# Altium schematic sheet 3_IMU.SchDoc
size A4; SheetNumber: 4; SheetTotal: 6
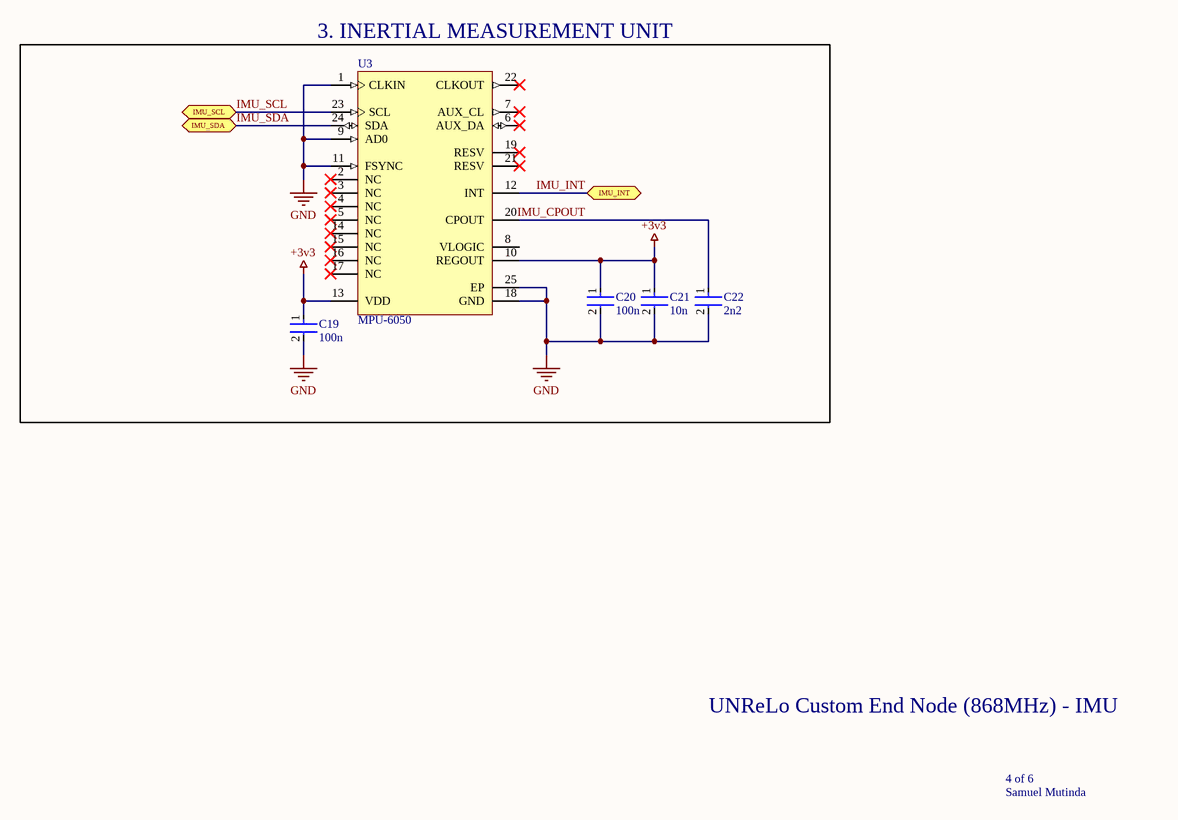
[diagram p0: 3_IMU.SchDoc]

## Parts
C19  100n  [FP-C0402-BB-MFG]
C20  100n  [FP-C0402-BB-MFG]
C21  10n  [FP-C0402-BB-MFG]
C22  2n2  [FP-C0402-BB-MFG]
U3  MPU-6050  [IS-QFN-24_V]

## Blocks framed on the sheet
3. INERTIAL MEASUREMENT UNIT: C19-C22 U3

## Ports
IMU_INT (bidir), IMU_SCL (bidir), IMU_SDA (bidir)

## Nets
+3v3: C19.1 C20.1 C21.1 U3.10(REGOUT) U3.13(VDD)
GND: C19.2 C20.2 C21.2 C22.2 U3.1(CLKIN) U3.9(AD0) U3.11(FSYNC) U3.18(GND) U3.25(EP)
IMU_CPOUT: C22.1 U3.20(CPOUT)
IMU_INT: U3.12(INT) ; port IMU_INT
IMU_SCL: U3.23(SCL) ; port IMU_SCL
IMU_SDA: U3.24(SDA) ; port IMU_SDA

Not connected (* = marked no-connect by the designer): U3 2(NC)* 3(NC)* 4(NC)* 5(NC)* 6(AUX_DA)* 7(AUX_CL)* 8(VLOGIC) 14(NC)* 15(NC)* 16(NC)* 17(NC)* 19(RESV)* 21(RESV)* 22(CLKOUT)*

## Notes on the sheet
- UNReLo Custom End Node (868MHz) - IMU
- 4 of 6
- Samuel Mutinda

## Library data of the parts
C19 = CMP-1034-02068-3: CAP CER 0.1UF 16V 5% X7R 0402; Manufacturer 1: TDK Corporation; Value: 0.10 μF; Temperature Coefficient: 15%; Tolerance: 0.05; Material: Ceramic; Name: CGA2B1X7R1C104K050BC; ComponentLink2URL: https://content.kemet.com/datasheets/KEM_C1002_X7R_SMD.pdf; Automotive: No; Device Class L2: Capacitors; Temperature: -55°C to +125°C; RoHS: TRUE; Voltage Rating: 16 V; ComponentLink2Description: Datasheet; Device Class L3: Ceramic Capacitors; Temperature Range Low: -55°C; Ipc Land Pattern Name: CAPC10050X50; Device Class L1: Passive Components; Temperature Range High: +125°C; Package: C0402-BB; Capacitance: 0.10 μF; Category: Cap; Mouser Description: CAP CER 0.1UF 16V X7R 0402; Height: 0.55mm; Digikey Description: CAP CER 0.1UF 16V 5% X7R 0402; Octopart: https://octopart.com/c0402c104j4ractu-kemet-12573893; Temperature Characteristic: X7R; Lead Free: Yes; Manufacturer Part Number 1: CGA2B1X7R1C104K050BC; Supplier 1: Digi-Key; Supplier Part Number 1: 445-5613-1-ND; Supplier Unit Price 1: $0.1
C20 = CMP-1034-02068-3: CAP CER 0.1UF 16V 5% X7R 0402; Manufacturer 1: TDK Corporation; Manufacturer Part Number: C0402C104J4RACTU; Value: 0.10 μF; Temperature Coefficient: 15%; Tolerance: 0.05; Material: Ceramic; Name: CGA2B1X7R1C104K050BC; ComponentLink2URL: https://content.kemet.com/datasheets/KEM_C1002_X7R_SMD.pdf; Automotive: No; Device Class L2: Capacitors; Temperature: -55°C to +125°C; RoHS: TRUE; Voltage Rating: 16 V; ComponentLink2Description: Datasheet; Device Class L3: Ceramic Capacitors; Temperature Range Low: -55°C; Ipc Land Pattern Name: CAPC10050X50; Device Class L1: Passive Components; Temperature Range High: +125°C; Package: C0402-BB; Capacitance: 0.10 μF; Category: Cap; Mouser Description: CAP CER 0.1UF 16V X7R 0402; Height: 0.55mm; Digikey Description: CAP CER 0.1UF 16V 5% X7R 0402; Octopart: https://octopart.com/c0402c104j4ractu-kemet-12573893; Temperature Characteristic: X7R; Lead Free: Yes; Manufacturer Part Number 1: CGA2B1X7R1C104K050BC; Supplier 1: Digi-Key; Supplier Part Number 1: 445-5613-1-ND; Supplier Unit Price 1: $0.1
C21 = CMP-1034-02068-3: CAP CER 0402 10NF 50V X7R 5%; Manufacturer 1: KEMET; Manufacturer Part Number: C0402C104J4RACTU; Value: 0.01 μF; Temperature Coefficient: 15%; Tolerance: 0.05; Material: Ceramic; Name: C0402C103J5RECAUTO; ComponentLink2URL: https://content.kemet.com/datasheets/KEM_C1002_X7R_SMD.pdf; Automotive: No; Device Class L2: Capacitors; Temperature: -55°C to +125°C; RoHS: TRUE; Voltage Rating: 50 V; ComponentLink2Description: Datasheet; Device Class L3: Ceramic Capacitors; Temperature Range Low: -55°C; Ipc Land Pattern Name: CAPC10050X50; Device Class L1: Passive Components; Temperature Range High: +125°C; Package: C0402-BB; Capacitance: 0.01 μF; Category: Cap; Mouser Description: CAP CER 0402 10NF 50V X7R 5%; Height: 0.55mm; Digikey Description: CAP CER 0402 10NF 50V X7R 5%; Octopart: https://octopart.com/c0402c104j4ractu-kemet-12573893; Temperature Characteristic: X7R; Lead Free: Yes; Manufacturer Part Number 1: C0402C103J5RECAUTO; Supplier 1: Digi-Key; Supplier Part Number 1: 399-C0402C103J5RECAUTOCT-ND; Supplier Unit Price 1: $0.18
C22 = CMP-1034-02068-3: CAP CER 0.1UF 16V 5% X7R 0402; Manufacturer 1: KEMET; Value: 2.2 nF; Voltage Rating: 25 V; Temperature Coefficient: 15%; Tolerance: 0.05; Material: Ceramic; Name: C0402C222K3RECAUTO; ComponentLink2URL: https://content.kemet.com/datasheets/KEM_C1002_X7R_SMD.pdf; Automotive: No; Device Class L2: Capacitors; Temperature: -55°C to +125°C; RoHS: TRUE; ComponentLink2Description: Datasheet; Device Class L3: Ceramic Capacitors; Temperature Range Low: -55°C; Ipc Land Pattern Name: CAPC10050X50; Device Class L1: Passive Components; Temperature Range High: +125°C; Package: C0402-BB; Capacitance: 2.2 nF; Category: Cap; Mouser Description: CAP CER 0402 2.2NF 25V X7R 10%; Height: 0.55mm; Digikey Description: CAP CER 0402 2.2NF 25V X7R 10%; Octopart: https://octopart.com/c0402c104j4ractu-kemet-12573893; Temperature Characteristic: X7R; Lead Free: Yes; Manufacturer Part Number 1: C0402C222K3RECAUTO; Supplier 1: Digi-Key; Supplier Part Number 1: 399-C0402C222K3RECAUTOCT-ND; Supplier Unit Price 1: $0.15
U3 = CMP-1753-00002-2: 3-Axis Gyroscope, Accelerometer and a Digital Motion Processor(TM) (DMP), 2.375 to 3.46 V, -40 to 85 degC, 24-Pin QFN, RoHS, Tape and Reel; Manufacturer 1: TDK InvenSense; Featured Product: MPU-60506-Axis,IntegratedI²CSolution; Other Names: 1428-1007-2 / MPU6050; Sensor Type: MotionTracking; Online Catalog: MPU-6000™Series; Unit PriceUSD: Digital; Datasheet Version: Rev. 3.3, 05/2012; Category: Sensors,Transducers; Datasheet URL: http://datasheet.octopart.com/MPU-6050-InvenSense-datasheet-14421344.pdf; Family: Multifunction; Standard Package: 5,000; Manufacturer URL: http://www.invensense.com/; Output Type: Digital; Dynamic Catalog: MPU-6000™Series; Name: MPU-6050; Manufacturer Part Number 1: MPU-6050; Supplier 1: Digi-Key; Supplier Part Number 1: 1428-1007-1-ND; Supplier Unit Price 1: $9.11